# EasyEDA Pro project ProPrj_32最小系统_2025-06-29.epro

# Schematic Schematic1

## Sheets
1 P1: Board Name: Board1; Create Date: 2025-01-07; Page Name: P1; Project Name: 32最小系统; Schematic Name: Schematic1; Update Date: 2025-01-07; Company: 嘉立创EDA; Page Size: A4; Version: V1.0
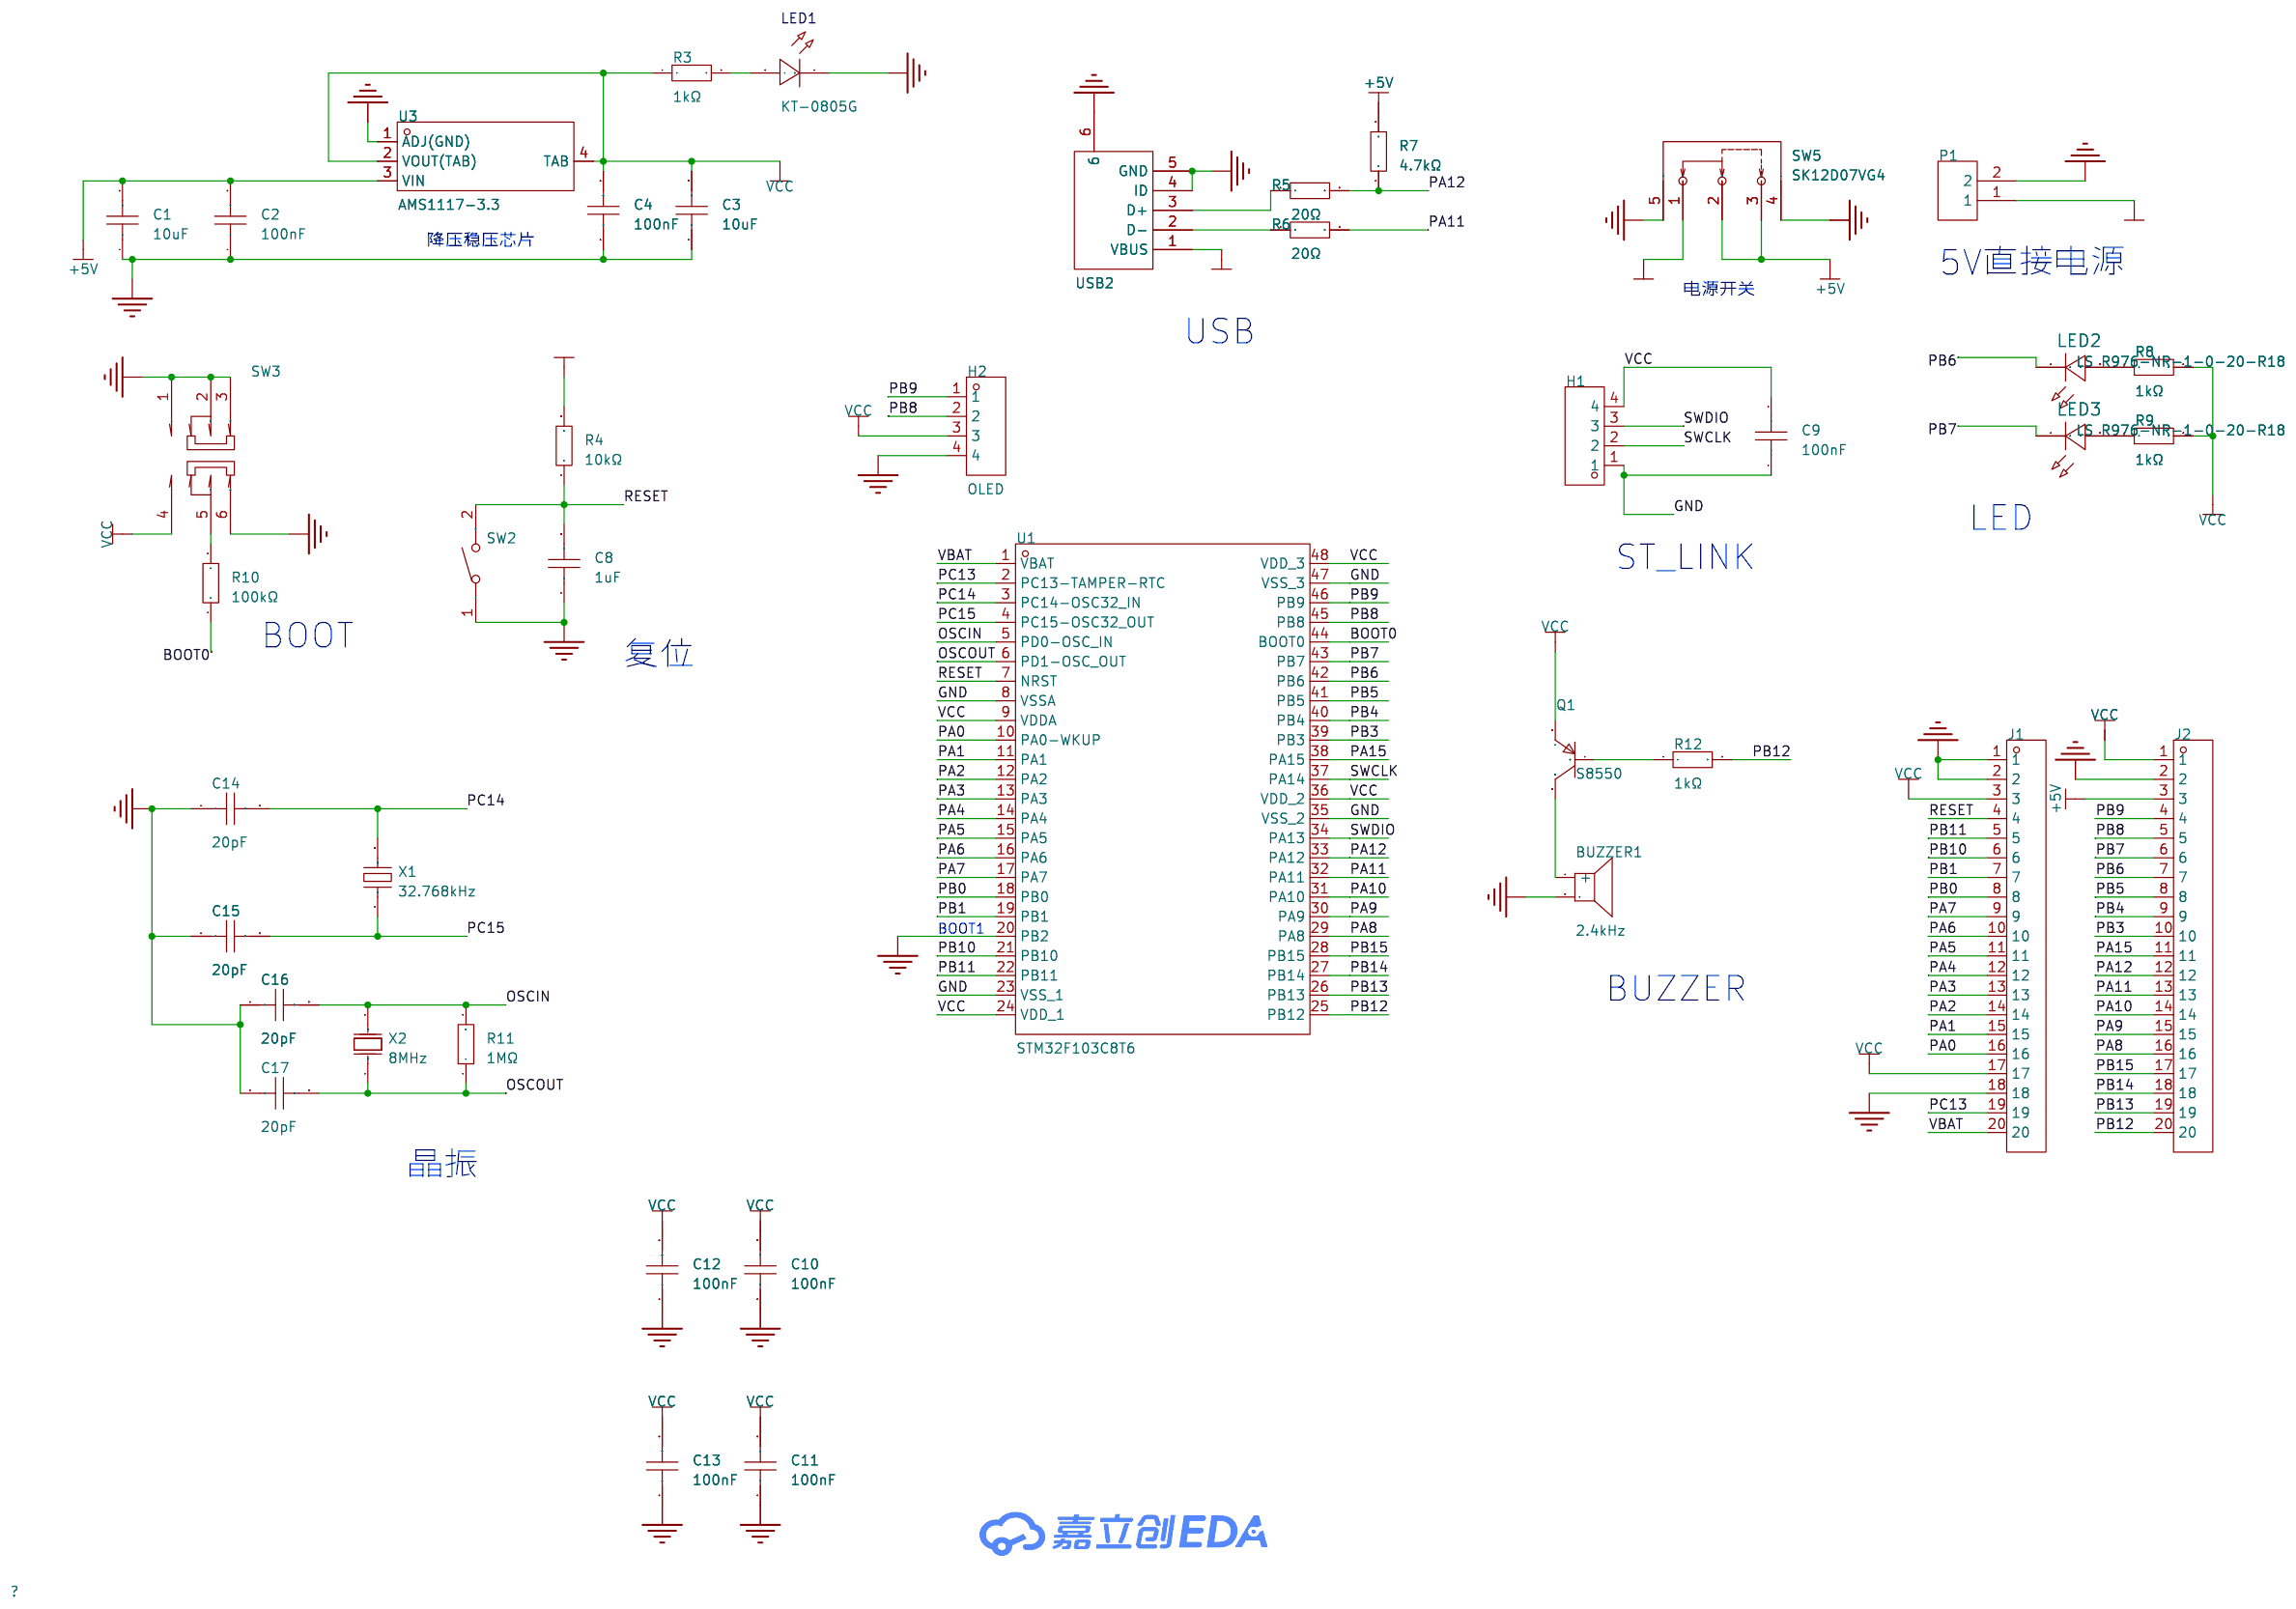
[diagram p0: P1]
2 P2: Page Name: P2
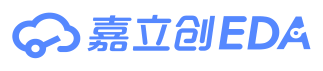
[diagram p1: P2]

## Parts
BUZZER1  2.4kHz  [BUZ-TH_BD12.0-P7.60-D0.6-FD]
C1  10uF  [C0805]
C2  100nF  [C0805]
C3  10uF  [C0805]
C4  100nF  [C0805]
C8  1uF  [C0805]
C9  100nF  [C0805]
C10  100nF  [C0805]
C11  100nF  [C0805]
C12  100nF  [C0805]
C13  100nF  [C0805]
C14  20pF  [C0805]
C15  20pF  [C0805]
C16  20pF  [C0805]
C17  20pF  [C0805]
H1  PZ254V-11-04P  [HDR-TH_4P-P2.54-V-M]
H2  OLED  [HDR-TH_4P-P2.54-V-F]
J1  2.54-1*20P直针  [HDR-TH_20P-P2.54-V-M-1]
J2  2.54-1*20P直针  [HDR-TH_20P-P2.54-V-M-1]
LED1  KT-0805G  [LED0805-R-RD]
LED2  LS R976-NR-1-0-20-R18  [LED0805-RD_RED]
LED3  LS R976-NR-1-0-20-R18  [LED0805-RD_RED]
P1  WJ500V-5.08-2P  [CONN-TH_2P-P5.00_WJ500V-5.08-2P]
Q1  S8550  [SOT-23-3_L2.9-W1.3-P1.90-LS2.4-BR]
R3  1kΩ  [R0805]
R4  10kΩ  [R0805]
R5  20Ω  [R0805]
R6  20Ω  [R0805]
R7  4.7kΩ  [R0805]
R8  1kΩ  [R0805]
R9  1kΩ  [R0805]
R10  100kΩ  [R0805]
R11  1MΩ  [R0805]
R12  1kΩ  [R0805]
SW2  TS-1088-AR02016  [SW-SMD_L3.9-W3.0-P4.45]
SW3  SS-3235S-L1  [SW-SMD_SS-3235S-LX]
SW5  SK12D07VG4  [SW-TH_SK12D07VG4]
U1  STM32F103C8T6  [LQFP-48_L7.0-W7.0-P0.50-LS9.0-BL]
U3  AMS1117-3.3  [SOT-223-4_L6.5-W3.5-P2.30-LS7.0-BR]
USB2  MICRO5.9mmusb  [MICRO-USB-SMD_5P-P0.65-H-F_MICRO5.9MMUSB]
X1  32.768kHz  [CRYSTAL-SMD_L7.0-W3.2-LS7.5]
X2  8MHz  [HC-49US_L11.5-W4.5-P4.88]

## Library data of the parts
BUZZER1 = TMB12A05_C96093: 驱动方式:有源(内含驱动线路);构造类型:电磁式;额定电压:-;频率:2.4kHz;声压(SPL):85dB;; LCSC Part Name: TMB12A05; Supplier Part: C96093; Manufacturer: 华能; Manufacturer Part: TMB12A05; Supplier Footprint: 插件,D=12mm; JLCPCB Part Class: Extended Part; Datasheet: https://atta.szlcsc.com/upload/public/pdf/source/20241025/8A17FE04D767D19A35A06DEF9A82AB1E.pdf; Supplier: LCSC; Oscillator Circuit: 有源(内含驱动线路); Technology Type: 电磁式; Operating Voltage: 4V~8V; Sound Pressure Level (SPL): 85dB; Diameter (φD): 12mm; Height: 9.8mm; Driver Circuitry: 有源(内含驱动线路); Technology: 电磁式; Voltage - Supply: 4V~8V; Sound Pressure Level(SPL): 85dB; Diameter(φD): 12mm
C1 C3 = CL21A106KOQNNNE: 容值:10uF;精度:±10%;额定电压:16V;材质(温度系数):X5R;; LCSC Part Name: 10uF ±10% 16V; Supplier Part: C1713; Manufacturer: SAMSUNG(三星); Supplier Footprint: 0805; JLCPCB Part Class: Extended Part; Datasheet: https://atta.szlcsc.com/upload/public/pdf/source/20160218/1457707763339.pdf; Supplier: LCSC; Tolerance: ±10%; Voltage Rated: 16V; Temperature Coefficient: X5R
C2 C4 C9-C13 = CC0805KRX7R9BB104: 容值:100nF;精度:±10%;额定电压:50V;材质(温度系数):X7R;; LCSC Part Name: 100nF ±10% 50V; Supplier Part: C49678; Manufacturer: YAGEO(国巨); Supplier Footprint: 0805; JLCPCB Part Class: Basic Part; Datasheet: https://atta.szlcsc.com/upload/public/pdf/source/20180224/C181747_15194369449651363981.pdf; Supplier: LCSC; Tolerance: ±10%; Voltage Rated: 50V; Temperature Coefficient: X7R
C8 = CL21B105KBFNNNE: 容值:1uF;精度:±10%;额定电压:50V;材质(温度系数):X7R;; LCSC Part Name: 1uF ±10% 50V; Supplier Part: C28323; Manufacturer: SAMSUNG(三星); Supplier Footprint: 0805; JLCPCB Part Class: Basic Part; Datasheet: https://atta.szlcsc.com/upload/public/pdf/source/20160218/1457707763339.pdf; Supplier: LCSC; Tolerance: ±10%; Voltage Rated: 50V; Temperature Coefficient: X7R
C14-C17 = CL21C200JBANNNC: 容值:20pF;精度:±5%;额定电压:50V;材质(温度系数):C0G;; LCSC Part Name: 20pF ±5% 50V; Supplier Part: C1798; Manufacturer: SAMSUNG(三星); Supplier Footprint: 0805; JLCPCB Part Class: Basic Part; Datasheet: https://atta.szlcsc.com/upload/public/pdf/source/20160218/1457707763339.pdf; Supplier: LCSC; Tolerance: ±5%; Voltage Rated: 50V; Temperature Coefficient: C0G
H1 = PZ254V-11-04P: 插针结构:1x4P;间距:2.54mm;行距:-;圆针/方针:方针;安装类型:直插;排数:单排;总PIN位数:4P;额定电流:3A;额定电压:250V;配合针长度:6mm;塑高:2.5mm;端接针长度:3mm;触头材质:-;工作温度范围:-40℃~+105℃;颜色:黑色;; LCSC Part Name: 间距:2.54mm 1x4P 直插 方针; Supplier Part: C2691448; Manufacturer: XFCN(兴飞); Supplier Footprint: 插件,P=2.54mm; JLCPCB Part Class: 扩展库; Datasheet: https://atta.szlcsc.com/upload/public/pdf/source/20200309/C492403_F9F19131791D08044AD4F84F8E751A34.pdf; Supplier: LCSC; Pin Structure: 1x4P; Pitch: 2.54mm; Circluar Pins/Square Pins: 方针; Mounting Type: 直插; Number of Rows: 单排; Number of Pins: 4P; Current Rating (Max): 3A; Voltage Rating (Max): 250V; Length of Mating Pin: 6mm; Insulation Height: 2.5mm; Length of End Connection Pin: 3mm; Operating Temperature Range: -40℃~+105℃; Color: 黑色
H2 = 2.54-1*4P母: 插孔结构:1x4P;间距:2.54mm;行距:-;圆孔/方孔:方孔;安装类型:直插;排数:单排;总孔位数:4P;额定电流:3A;额定电压:-;插孔方向:顶部;塑高:-;触头材质:青铜;触头镀层:-;工作温度范围:-40℃~+105℃;焊接温度(最大值):-;; LCSC Part Name: 间距:2.54mm 1x4P 直插; Supplier Part: C2718488; Manufacturer: BOOMELE(博穆精密); Supplier Footprint: 插件,P=2.54mm; JLCPCB Part Class: 扩展库; Datasheet: https://atta.szlcsc.com/upload/public/pdf/source/20210301/C2718488_F4427B881E42CAA8DDB0B1C12B3A522C.pdf; Supplier: LCSC; Holes Structure: 1x4P; Pitch: 2.54mm; Circular Hole / Square Hole: 方孔; Mounting Type: 直插; Number of Rows: 单排; Number of Holes: 4P; Current Rating (Max): 3A; Holes Direction: 顶部; Contact Material: 青铜; Operating Temperature Range: -40℃~+105℃
J1 J2 = 2.54-1*20P直针: 插针结构:1x20P;间距:2.54mm;行距:-;圆针/方针:方针;安装类型:直插;排数:单排;总PIN位数:20P;额定电流:3A;额定电压:-;配合针长度:-;塑高:-;端接针长度:-;触头材质:黄铜;触头镀层:-;工作温度范围:-40℃~+105℃;颜色:黑色;; LCSC Part Name: 间距:2.54mm 1x20P 直插 方针; Supplier Part: C50981; Manufacturer: BOOMELE(博穆精密); Supplier Footprint: 插件,P=2.54mm; JLCPCB Part Class: 扩展库; Datasheet: https://atta.szlcsc.com/upload/public/pdf/source/20151109/1457707572883.pdf; Supplier: LCSC; Pin Structure: 1x20P; Pitch: 2.54mm; Circluar Pins/Square Pins: 方针; Mounting Type: 直插; Number of Rows: 单排; Number of Pins: 20P; Current Rating (Max): 3A; Contact Material: 黄铜; Operating Temperature Range: -40℃~+105℃; Color: 黑色
LED1 = KT-0805G: 灯头类型:-;发光颜色:翠绿色;正向电压(VF):-;功率:-;正向电流:-;主波长:-;二极管配置:-;透镜颜色:-;色温:-;发光强度:-;发光角度:-;载带方式:-;工作温度:-;; LCSC Part Name: 0805 翠绿 高亮; Supplier Part: C2297; Manufacturer: KENTO; Supplier Footprint: 0805; JLCPCB Part Class: Basic Part; Datasheet: https://atta.szlcsc.com/upload/public/pdf/source/20170209/1486607340485.pdf; Supplier: LCSC; Emitted Color: 翠绿色
LED2 LED3 = LS R976-NR-1-0-20-R18: LCSC Part Name: 0805红(雾状); Supplier Part: C2899997; Manufacturer: OSRAM(欧司朗); Supplier Footprint: 0805; JLCPCB Part Class: Extended Part; Datasheet: https://atta.szlcsc.com/upload/public/pdf/source/20220714/A56A54169E2209C0CCFAD963EE2FAFD1.pdf; Supplier: LCSC
P1 = WJ500V-5.08-2P: 结构:1x2P;间距:5.08mm;颜色:绿色;安装方式:直插;额定电流:18A;额定电压:250V;排数:1;线规 - AWG:14~30;线规 - 平方毫米:2.5;每排PIN数:2;触头材质:-;触头镀层:-;工作温度范围:-40℃~+105℃;焊接温度(最大值):-;; LCSC Part Name: 1x2P 5.08mm 直插 排数:1 每排P数:2; Supplier Part: C8465; Manufacturer: KANGNEX(康奈克斯电气); Supplier Footprint: 插件,P=5.08mm; JLCPCB Part Class: 扩展库; Datasheet: https://atta.szlcsc.com/upload/public/pdf/source/20191225/C8465_02D34CE5B5B4A53DF5891601D97FA9F4.pdf; Supplier: LCSC; Structure: 1x2P; Pitch: 5.08mm; Color: 绿色; Mounting Style: 直插; Current Rating (Max): 18A; Voltage Rating (Max): 250V; Number of Pins: 2P; Number of Rows: 1; Wire Gauge - AWG: 14~30; Wire Gauge - mm2: 2.5; Number of PINs Per Row: 2; Operating Temperature Range: -40℃~+105℃; Screw Specification: M2.5
Q1 = S8550_C5184407: 晶体管类型:PNP;集电极电流(Ic):500mA;集射极击穿电压(Vceo):25V;功率(Pd):300mW;直流电流增益(hFE@Ic,Vce):120@50mA,1V;; LCSC Part Name: PNP 电流:500mA 耐压:25V; Supplier Part: C5184407; Manufacturer: HXY MOSFET(华轩阳电子); Supplier Footprint: SOT-23; JLCPCB Part Class: 扩展库; Datasheet: https://atta.szlcsc.com/upload/public/pdf/source/20241014/49AFEAC0A66233679E8DD051807D6398.pdf; Supplier: LCSC; Transistor Type: PNP; Collector Current (Ic): 500mA; Collector-Emitter Breakdown Voltage (Vceo): 25V; Power Dissipation (Pd): 300mW; DC Current Gain (hFE@Ic,Vce): 120@50mA,1V; Transition Frequency (fT): 150MHz; Collector Cut-Off Current (Icbo): 100nA; Collector-Emitter Saturation Voltage (VCE(sat)@Ic,Ib): 600mV@500mA,50mA
R3 R8 R9 R12 = 0805W8F1001T5E: 电阻类型:厚膜电阻;阻值:1kΩ;精度:±1%;功率:125mW;最大工作电压:150V;温度系数:±100ppm/℃;; LCSC Part Name: 1kΩ ±1% 125mW 厚膜电阻; Supplier Part: C17513; Manufacturer: UNI-ROYAL(厚声); Supplier Footprint: 0805; JLCPCB Part Class: Basic Part; Datasheet: https://atta.szlcsc.com/upload/public/pdf/source/20200306/C422600_1E6D84923E4A46A82E41ADD87F860B5C.pdf; Supplier: LCSC; Type: 厚膜电阻; Tolerance: ±1%; Power(Watts): 125mW; Overload Voltage (Max): 150V; Temperature Coefficient: ±100ppm/℃; Operating Temperature Range: -55℃~+155℃
R4 = 0805W8F1002T5E_C17414: 电阻类型:厚膜电阻;阻值:10kΩ;精度:±1%;功率:125mW;最大工作电压:150V;温度系数:±100ppm/℃;; LCSC Part Name: 10kΩ ±1% 125mW 厚膜电阻; Supplier Part: C17414; Manufacturer: UNI-ROYAL(厚声); Manufacturer Part: 0805W8F1002T5E; Supplier Footprint: 0805; JLCPCB Part Class: Basic Part; Datasheet: https://atta.szlcsc.com/upload/public/pdf/source/20200306/C422600_1E6D84923E4A46A82E41ADD87F860B5C.pdf; Supplier: LCSC; Type: 厚膜电阻; Tolerance: ±1%; Power(Watts): 125mW; Overload Voltage (Max): 150V; Temperature Coefficient: ±100ppm/℃; Operating Temperature Range: -55℃~+155℃
R5 R6 = 0805W8F200JT5E: 电阻类型:厚膜电阻;阻值:20Ω;精度:±1%;功率:125mW;最大工作电压:150V;温度系数:±200ppm/℃;; LCSC Part Name: 20Ω ±1% 125mW 厚膜电阻; Supplier Part: C17544; Manufacturer: UNI-ROYAL(厚声); Supplier Footprint: 0805; JLCPCB Part Class: Basic Part; Datasheet: https://atta.szlcsc.com/upload/public/pdf/source/20200306/C422600_1E6D84923E4A46A82E41ADD87F860B5C.pdf; Supplier: LCSC; Type: 厚膜电阻; Tolerance: ±1%; Power(Watts): 125mW; Overload Voltage (Max): 150V; Temperature Coefficient: ±200ppm/℃; Operating Temperature Range: -55℃~+155℃
R7 = 0805W8F4701T5E: 电阻类型:厚膜电阻;阻值:4.7kΩ;精度:±1%;功率:125mW;最大工作电压:150V;温度系数:±100ppm/℃;; LCSC Part Name: 4.7kΩ ±1% 125mW 厚膜电阻; Supplier Part: C17673; Manufacturer: UNI-ROYAL(厚声); Supplier Footprint: 0805; JLCPCB Part Class: Basic Part; Datasheet: https://atta.szlcsc.com/upload/public/pdf/source/20200306/C422600_1E6D84923E4A46A82E41ADD87F860B5C.pdf; Supplier: LCSC; Type: 厚膜电阻; Tolerance: ±1%; Power(Watts): 125mW; Overload Voltage (Max): 150V; Temperature Coefficient: ±100ppm/℃; Operating Temperature Range: -55℃~+155℃
R10 = 0805W8F1003T5E: 电阻类型:厚膜电阻;阻值:100kΩ;精度:±1%;功率:125mW;最大工作电压:150V;温度系数:±100ppm/℃;; LCSC Part Name: 100kΩ ±1% 125mW 厚膜电阻; Supplier Part: C149504; Manufacturer: UNI-ROYAL(厚声); Supplier Footprint: 0805; JLCPCB Part Class: Basic Part; Datasheet: https://atta.szlcsc.com/upload/public/pdf/source/20200306/C422600_1E6D84923E4A46A82E41ADD87F860B5C.pdf; Supplier: LCSC; Type: 厚膜电阻; Tolerance: ±1%; Power(Watts): 125mW; Overload Voltage (Max): 150V; Temperature Coefficient: ±100ppm/℃; Operating Temperature Range: -55℃~+155℃
R11 = 0805W8F1004T5E: 电阻类型:厚膜电阻;阻值:1MΩ;精度:±1%;功率:125mW;最大工作电压:150V;温度系数:±100ppm/℃;; LCSC Part Name: 1MΩ ±1% 125mW 厚膜电阻; Supplier Part: C17514; Manufacturer: UNI-ROYAL(厚声); Supplier Footprint: 0805; JLCPCB Part Class: Basic Part; Datasheet: https://atta.szlcsc.com/upload/public/pdf/source/20200306/C422600_1E6D84923E4A46A82E41ADD87F860B5C.pdf; Supplier: LCSC; Type: 厚膜电阻; Tolerance: ±1%; Power(Watts): 125mW; Overload Voltage (Max): 150V; Temperature Coefficient: ±100ppm/℃; Operating Temperature Range: -55℃~+155℃
SW2 = TS-1088-AR02016: 电路结构:单刀单掷;按钮形状:圆形按钮;作用力:160gf;安装方式:立贴;开关长度:4mm;开关宽度:3mm;开关高度:2mm;带支架:不带;触点电流:50mA;额定电压(DC):12V;绝缘电阻:100MΩ;机械寿命:10万次;; LCSC Part Name: 4*3*2mm 立贴 轻触开关; Supplier Part: C720477; Manufacturer: XUNPU(讯普); Supplier Footprint: SMD; JLCPCB Part Class: 扩展库; Datasheet: https://atta.szlcsc.com/upload/public/pdf/source/20200810/C720475_60D09DD6C54279ADDB2DC25100F1CC11.pdf; Supplier: LCSC; Circuit: 单刀单掷; Actuator Style: 圆形按钮; Operating Force: 160gf; Mounting Style: 立贴; Switch Length: 4mm; Switch Width: 3mm; Switch Height: 2mm; Strike Gundam: 不带; Contact Current: 50mA; Voltage Rating (DC): 12V; Insulation Resistance: 100MΩ; Actuator/Cap Color: 黑色; Pin Style: SMD接片; Mechanical Life: 10万次; Operating Temperature: -30℃~+80℃
SW3 = SS-3235S-L1: 电路结构:双刀双掷;安装方式:卧贴;开关颜色:黑色;额定电流(DC):50mA;额定电压(DC):12V;额定电流(AC):50mA;额定电压(AC):12V;机械寿命:1万次;; LCSC Part Name: 柄长2mm 卧贴双档 滑动开关; Supplier Part: C500055; Manufacturer: XKB Connectivity(中国星坤); Supplier Footprint: SMD; JLCPCB Part Class: 扩展库; Datasheet: https://atta.szlcsc.com/upload/public/pdf/source/20211011/39D516E750C13BE9339464E723D9F132.pdf; Supplier: LCSC; Circuit: 双刀双掷; Actuator Style: 矩形柱状; Pin Style: 鸥翼型; Switch Length: 9.1mm; Switch Width: 3.55mm; Switch Height: 3.2mm; Mounting Style: 卧贴; Actuator Color: 黑色; Current Rating (DC): 50mA; Voltage Rating (DC): 12V; Current Rating (AC): 50mA; Voltage Rating (AC): 12V; Mechanical Life: 1万次; Operating Temperature: -40℃~+85℃
SW5 = SK12D07VG4: 电路结构:单刀双掷;安装方式:-;额定电流(DC):500mA;额定电压(DC):50V;额定电流(AC):-;额定电压(AC):-;机械寿命:5千次;; LCSC Part Name: 3脚2档位 卧插 滑动开关; Supplier Part: C393937; Manufacturer: SHOU HAN(首韩); Supplier Footprint: 插件; JLCPCB Part Class: 扩展库; Datasheet: https://atta.szlcsc.com/upload/public/pdf/source/20190521/C393937_939FE26E571CC67D2D532E953108A1B0.pdf; Supplier: LCSC; Circuit: 单刀双掷; Actuator Style: 矩形柱状; Pin Style: PC引脚; Switch Height: 8.8mm; Current Rating (DC): 500mA; Voltage Rating (DC): 50V; Mechanical Life: 5千次
U1 = STM32F103C8T6: CPU内核:ARM-M3;CPU最大主频:72MHz;应用领域:-;; LCSC Part Name: 主流增强型ARM Cortex-M3 MCU，具有64 KB Flash、72 MHz CPU、电机控制、USB和CAN; Supplier Part: C8734; Manufacturer: ST(意法半导体); Supplier Footprint: LQFP-48(7x7); JLCPCB Part Class: 扩展库; Datasheet: https://atta.szlcsc.com/upload/public/pdf/source/20220812/8363ACEC51AD55ECEB84799464F7CB85.pdf; Supplier: LCSC; CPU Core: ARM-M3; CPU Maximum Speed: 72MHz; Program Storage Size: 64KB; Program Memory Type: FLASH; GPIO Ports Number: 37; ADC (Bit): 12bit; Low Voltage Detection Threshold: 2V~3.6V
U3 = AMS1117-3.3_C347222: 输出类型:固定;工作电压:12V;输出电压:3.3V;输出电流:1A;电源纹波抑制比(PSRR):60dB@(120Hz);输出极性:正极;; LCSC Part Name: 输出:3.3V 电流:1A 耐压:12V; Supplier Part: C347222; Manufacturer: UMW(友台半导体); Supplier Footprint: SOT-223; JLCPCB Part Class: 扩展库; Datasheet: https://atta.szlcsc.com/upload/public/pdf/source/20241218/BAF0263FA2E44BCD8AF41AA4FA04EFAA.pdf; Supplier: LCSC; Output Type: 固定; Maximum Input Voltage: 12V; Output Voltage: 3.3V; Output Current: 1A; Power Supply Rejection Ratio (PSRR): 60dB@(120Hz); Dropout Voltage: 1.3V@(1A); Feature: 过流保护(OCP); Output Polarity: 正极; Number of Outputs: 1
USB2 = MICRO5.9mmusb: 连接器类型:Micro-B;标准:USB 2.0;公母:母;安装方式:卧贴;触点数量:5P;端口数量:1;额定电流 - 电源:1A;工作温度范围:-30℃~+80℃;; LCSC Part Name: Micro-B 母 卧贴; Supplier Part: C393940; Manufacturer: SHOU HAN(首韩); Supplier Footprint: SMD; JLCPCB Part Class: 扩展库; Datasheet: https://atta.szlcsc.com/upload/public/pdf/source/20190521/C393940_82CD1DF5E736059CF3459BCCC801B05D.pdf; Supplier: LCSC; Connector Type: Micro-B; Standard: USB 2.0; Gender: 母; Mounting Style: 卧贴; Number of Contacts: 5P; Number of Ports: 1; Current Rating - Power (Max): 1A; Operating Temperature Range: -30℃~+80℃; Core Colour: 黑色
X1 = FL37S2-32.768-NLLLDTL: 晶振类型:贴片晶振;频率:32.768kHz;常温频差:±20ppm;外接负载电容:12.5pF;频率稳定度(全温):±20ppm;; LCSC Part Name: 32.768kHz ±20ppm 12.5pF; Supplier Part: C3034396; Manufacturer: HCI(杭晶); Supplier Footprint: HC-49S-SMD-2P-Mini; JLCPCB Part Class: 扩展库; Datasheet: https://atta.szlcsc.com/upload/public/pdf/source/20220609/D6453C9B3A997B38AB72F764D1E691DB.pdf; Supplier: LCSC; Crystal Type: 贴片晶振; Normal temperature Frequency Tolerance: ±20ppm; External load capacitor: 12.5pF; Frequency Stability(Full temperature range): ±20ppm; Operating Temperature: -40℃~+85℃
X2 = TAXD8M2GLFBET2T: 晶振类型:直插晶振;频率:8MHz;常温频差:±30ppm;外接负载电容:20pF;频率稳定度(全温):±30ppm;; LCSC Part Name: 8MHz ±30ppm 20pF; Supplier Part: C107425; Manufacturer: YJX(雅晶鑫); Supplier Footprint: HC-49S; JLCPCB Part Class: 扩展库; Datasheet: https://atta.szlcsc.com/upload/public/pdf/source/20170914/C127676_1505359415156967690.pdf; Supplier: LCSC; Crystal Type: 直插晶振; Normal temperature Frequency Tolerance: ±30ppm; External load capacitor: 20pF; Frequency Stability(Full temperature range): ±30ppm; Equivalent Series Resistance (ESR): 80Ω; Operating Temperature: -20℃~+70℃

## Nets
+5V: C1.2 C2.2 J2.3 R7.2 SW5.2 SW5.3 U3.3(VIN)
+5V_IN: P1.1 SW5.1 USB2.1(VBUS)
GND: BUZZER1.2 C1.1 C2.1 C3.1 C4.1 C8.1 C9.1 C10.1 C11.1 C12.1 C13.1 C14.1 C15.1 C16.1 C17.1 H1.1 H2.4 J1.1 J1.2 J1.18 J2.2 LED1.1(C) P1.2 SW2.1 SW3.1 SW3.2 SW3.3 SW3.6 SW5.4 SW5.5 U1.8(VSSA) U1.20(PB2) U1.23(VSS_1) U1.35(VSS_2) U1.47(VSS_3) U3.1(ADJ(GND)) USB2.4(ID) USB2.5(GND) USB2.6
VBAT: J1.20 U1.1(VBAT)
VCC: C3.2 C4.2 C9.2 C10.2 C11.2 C12.2 C13.2 H1.4 H2.3 J1.3 J1.17 J2.1 Q1.2(E) R3.1 R4.2 R8.2 R9.2 SW3.4 U1.9(VDDA) U1.24(VDD_1) U1.36(VDD_2) U1.48(VDD_3) U3.2(VOUT(TAB)) U3.4(TAB)
BOOT0: R10.1 U1.44(BOOT0)
OSCIN: C16.2 R11.2 U1.5(PD0-OSC_IN) X2.2(OSC2)
OSCOUT: C17.2 R11.1 U1.6(PD1-OSC_OUT) X2.1(OSC1)
PA0: J1.16 U1.10(PA0-WKUP)
PA1: J1.15 U1.11(PA1)
PA2: J1.14 U1.12(PA2)
PA3: J1.13 U1.13(PA3)
PA4: J1.12 U1.14(PA4)
PA5: J1.11 U1.15(PA5)
PA6: J1.10 U1.16(PA6)
PA7: J1.9 U1.17(PA7)
PA8: J2.16 U1.29(PA8)
PA9: J2.15 U1.30(PA9)
PA10: J2.14 U1.31(PA10)
PA11: J2.13 R6.2 U1.32(PA11)
PA12: J2.12 R5.2 R7.1 U1.33(PA12)
PA15: J2.11 U1.38(PA15)
PB0: J1.8 U1.18(PB0)
PB1: J1.7 U1.19(PB1)
PB3: J2.10 U1.39(PB3)
PB4: J2.9 U1.40(PB4)
PB5: J2.8 U1.41(PB5)
PB6: J2.7 LED2.1(C) U1.42(PB6)
PB7: J2.6 LED3.1(C) U1.43(PB7)
PB8: H2.2 J2.5 U1.45(PB8)
PB9: H2.1 J2.4 U1.46(PB9)
PB10: J1.6 U1.21(PB10)
PB11: J1.5 U1.22(PB11)
PB12: J2.20 R12.2 U1.25(PB12)
PB13: J2.19 U1.26(PB13)
PB14: J2.18 U1.27(PB14)
PB15: J2.17 U1.28(PB15)
PC13: J1.19 U1.2(PC13-TAMPER-RTC)
PC14: C14.2 U1.3(PC14-OSC32_IN) X1.2(GND)
PC15: C15.2 U1.4(PC15-OSC32_OUT) X1.1
RESET: C8.2 J1.4 R4.1 SW2.2 U1.7(NRST)
SWCLK: H1.2 U1.37(PA14)
SWDIO: H1.3 U1.34(PA13)
$1N2331: R5.1 USB2.3(D+)
$1N2336: R6.1 USB2.2(D-)
$1N5496: Q1.1(B) R12.1
Net-(BUZZER1-1): BUZZER1.1(+) Q1.3(C)
Net-(LED1-2): LED1.2(A) R3.2
Net-(LED2-2): LED2.2(A) R8.1
Net-(LED3-2): LED3.2(A) R9.1
Net-(R10-2): R10.2 SW3.5

## Notes on the sheets
sheet 1
- 降压稳压芯片
- 电源开关
- 5V直接电源
- USB
- LED
- ST_LINK
- BOOT
- 复位
- BOOT1
- BUZZER
- 晶振

# Board PCB1
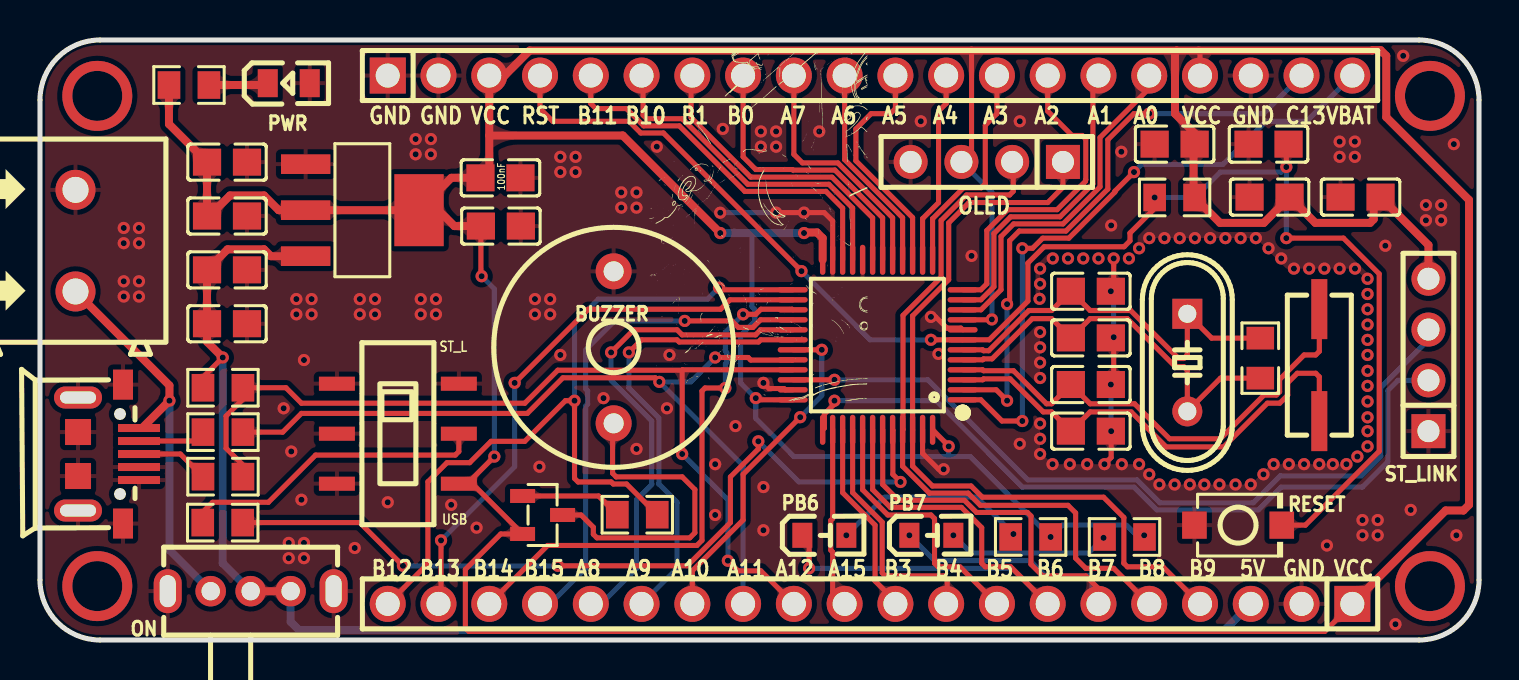
[diagram p2: board, top side]
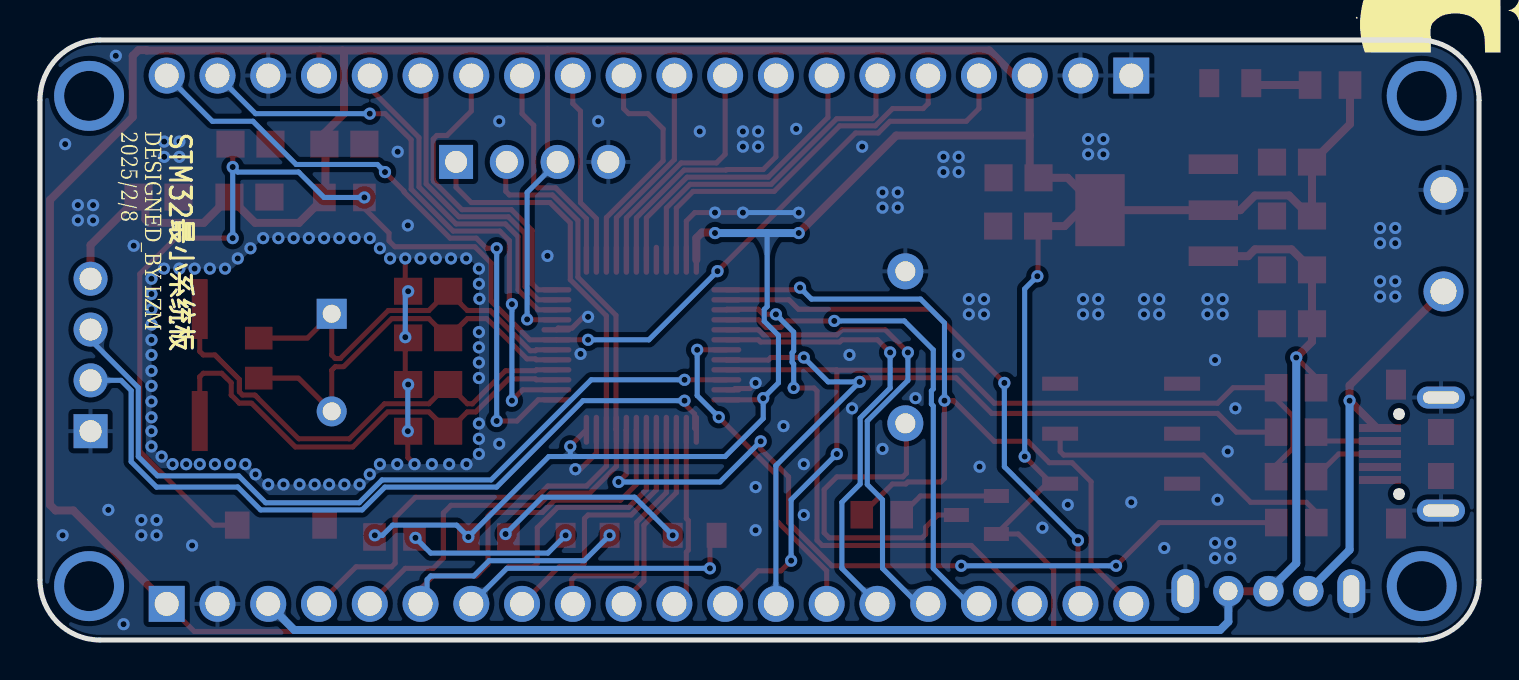
[diagram p3: board, bottom side, seen from below]

Outline 72 x 30 mm; copper layers: Top Layer, Bottom Layer. Coordinates in mm from the lower left corner of the outline.
Outline path: 0,27 0,3 arc(0.88,0.88) 3,0 69,0 arc(71.12,0.88) 72,3 72,27 arc(71.12,29.12) 69,30 3,30 arc(0.88,29.12) 0,27
Stack: Top Layer 0.035mm / Dielectric1 1.51mm FR4 er 4.5 / Bottom Layer 0.035mm

## Design rules (mm)
net PC14: DP2
net PC15: DP2
net OSCIN: DP1
net OSCOUT: DP1
template: JLCPCB Capability(Two Layers Board)
spacing copperThickness1oz (default): track to track 0.102, other pairs 0.152 to 0.3
spacing copperThickness2oz: track to track 0.203, other pairs 0.152 to 0.3
track width copperThickness1oz (default): min 0.127, default 0.254, max 2.54
track width copperThickness2oz: min 0.203, default 0.254, max 2.54
differential pair differentialPair (default): width min 0.127, default 0.254, max 2.54; gap min 0.152, default 0.152
via viaSize (default): diameter min 0.5, default 0.61, max 10; hole min 0.3, default 0.305, max 6.3

## Placement (name value [footprint] x y rotation side)
BUZZER  2.4kHz  [BUZ-TH_BD12.0-P7.60-D0.6-FD]  28.7 14.63 90 top
C1  10uF  [C0805]  9.36 15.81 180 top
C2  100nF  [C0805]  9.36 18.51 180 top
C3  10uF  [C0805]  9.36 21.2 180 top
C4  100nF  [C0805]  9.36 23.89 180 top
C8  1uF  [C0805]  61.47 24.79 0 top
C9  100nF  [C0805]  56.77 24.79 0 top
C10  100nF  [C0805]  23.04 23.11 180 top
C11  100nF  [C0805]  23.06 20.7 180 top
C12  100nF  [C0805]  61.52 22.14 0 top
C13  100nF  [C0805]  66.07 22.14 0 top
C14  20pF  [C0805]  52.58 10.44 180 top
C15  20pF  [C0805]  52.58 12.77 180 top
C16  20pF  [C0805]  52.58 15.11 180 top
C17  20pF  [C0805]  52.58 17.44 180 top
H2  OLED  [HDR-TH_4P-P2.54-V-F]  47.37 23.9 180 top
J1  2.54-1*20P直针  [HDR-TH_20P-P2.54-V-M-1]  41.53 28.22 0 top
J2  2.54-1*20P直针  [HDR-TH_20P-P2.54-V-M-1]  41.53 1.81 180 top
ON  SK12D07VG4  [SW-TH_SK12D07VG4]  10.54 2.44 0 top
P1  WJ500V-5.08-2P  [CONN-TH_2P-P5.00_WJ500V-5.08-2P]  1.78 19.97 90 top
PB6  LS R976-NR-1-0-20-R18  [LED0805-RD_RED]  39.24 5.23 0 top
PB7  LS R976-NR-1-0-20-R18  [LED0805-RD_RED]  44.6 5.23 0 top
PWR  KT-0805G  [LED0805-R-RD]  12.45 27.84 0 top
Q1  S8550  [SOT-23-3_L2.9-W1.3-P1.90-LS2.4-BR]  25.15 6.25 180 top
R3  1kΩ  [R0805]  7.45 27.75 0 top
R4  10kΩ  [R0805]  56.77 22.13 0 top
R5  20Ω  [R0805]  9.16 8.17 0 top
R6  20Ω  [R0805]  9.16 10.39 0 top
R7  4.7kΩ  [R0805]  9.16 12.61 180 top
R8  1kΩ  [R0805]  49.57 5.15 0 top
R9  1kΩ  [R0805]  54.26 5.15 0 top
R10  100kΩ  [R0805]  9.14 5.87 180 top
R11  1MΩ  [R0805]  61.05 14.09 270 top
R12  1kΩ  [R0805]  29.88 6.26 0 top
RESET  TS-1088-AR02016  [SW-SMD_L3.9-W3.0-P4.45]  59.94 5.74 0 top
ST_LINK  PZ254V-11-04P  [HDR-TH_4P-P2.54-V-M]  69.47 14.25 90 top
U1  STM32F103C8T6  [LQFP-48_L7.0-W7.0-P0.50-LS9.0-BL]  41.91 14.76 90 top
U3  AMS1117-3.3  [SOT-223-4_L6.5-W3.5-P2.30-LS7.0-BR]  16.13 21.49 180 top
USB  SS-3235S-L1  [SW-SMD_SS-3235S-LX]  17.91 10.31 90 top
USB2  MICRO5.9mmusb  [MICRO-USB-SMD_5P-P0.65-H-F_MICRO5.9MMUSB]  3.43 9.3 270 top
X1  32.768kHz  [CRYSTAL-SMD_L7.0-W3.2-LS7.5]  64.01 13.74 270 top
X2  8MHz  [HC-49US_L11.5-W4.5-P4.88]  57.4 13.87 270 top

## Footprints (pads in the part's own frame, mm; a bottom-side part is the same pattern mirrored in y, then rotated)
BUZ-TH_BD12.0-P7.60-D0.6-FD
  round 1.8 hole 1: 1(-3.8,0) 2(3.8,0)
C0805
  rect 1.41x1.35 smd: 1(-1,0) 2(1,0)
CONN-TH_2P-P5.00_WJ500V-5.08-2P
  round 2 hole 1.3: 1(-2.54,0) 2(2.54,0)
CRYSTAL-SMD_L7.0-W3.2-LS7.5
  rect 3x0.8 smd: 1(-2.8,0) 2(2.8,0)
HC-49US_L11.5-W4.5-P4.88
  rect 1.5x1.5 hole 0.9: 1(-2.44,0)
  round 1.5 hole 0.9: 2(2.44,0)
HDR-TH_4P-P2.54-V-F
  rect 1.7x1.7 hole 1.1: 1(-3.81,0)
  round 1.7 hole 1.1: 2(-1.27,0) 3(1.27,0) 4(3.81,0)
HDR-TH_4P-P2.54-V-M
  rect 1.7x1.7 hole 1.1: 1(-3.81,0)
  round 1.7 hole 1.1: 2(-1.27,0) 3(1.27,0) 4(3.81,0)
HDR-TH_20P-P2.54-V-M-1
  rect 1.8x1.8 hole 1.2: 1(-24.13,0)
  round 1.8 hole 1.2: 2(-21.59,0) 3(-19.05,0) 4(-16.51,0) 5(-13.97,0) 6(-11.43,0) 7(-8.89,0) 8(-6.35,0) 9(-3.81,0) 10(-1.27,0) 11(1.27,0) 12(3.81,0) 13(6.35,0) 14(8.89,0) 15(11.43,0) 16(13.97,0) 17(16.51,0) 18(19.05,0) 19(21.59,0) 20(24.13,0)
LED0805-R-RD
  rect 1x1.399 smd: 1(1.05,0) 2(-1.05,0)
LED0805-RD_RED
  rect 1x1.25 smd: 1(-1.1,0) 2(1.1,0)
LQFP-48_L7.0-W7.0-P0.50-LS9.0-BL
  oval 0.27x1.5 smd: 1(-2.75,-4.25) 2(-2.25,-4.25) 3(-1.75,-4.25) 4(-1.25,-4.25) 5(-0.75,-4.25) 6(-0.25,-4.25) 7(0.25,-4.25) 8(0.75,-4.25) 9(1.25,-4.25) 10(1.75,-4.25) 11(2.25,-4.25) 12(2.75,-4.25) 25(2.75,4.25) 26(2.25,4.25) 27(1.75,4.25) 28(1.25,4.25) 29(0.75,4.25) 30(0.25,4.25) 31(-0.25,4.25) 32(-0.75,4.25) 33(-1.25,4.25) 34(-1.75,4.25) 35(-2.25,4.25) 36(-2.75,4.25)
  oval 1.5x0.27 smd: 13(4.25,-2.75) 14(4.25,-2.25) 15(4.25,-1.75) 16(4.25,-1.25) 17(4.25,-0.75) 18(4.25,-0.25) 19(4.25,0.25) 20(4.25,0.75) 21(4.25,1.25) 22(4.25,1.75) 23(4.25,2.25) 24(4.25,2.75) 37(-4.25,2.75) 38(-4.25,2.25) 39(-4.25,1.75) 40(-4.25,1.25) 41(-4.25,0.75) 42(-4.25,0.25) 43(-4.25,-0.25) 44(-4.25,-0.75) 45(-4.25,-1.25) 46(-4.25,-1.75) 47(-4.25,-2.25) 48(-4.25,-2.75)
MICRO-USB-SMD_5P-P0.65-H-F_MICRO5.9MMUSB
  rect 0.4x2.1 smd: 1(-1.3,1.525) 2(-0.65,1.525) 3(0,1.525) 4(0.65,1.525) 5(1.3,1.525)
  rect 1.5x1 smd: 6(-3.47,0.725) 6(3.476,0.725)
  oval 1.1x2.4 hole 0.6x1.8: 6(-2.825,-1.525) 6(2.825,-1.525)
  rect 1.3x1.3 smd: 6(-1.1,-1.525) 6(1.1,-1.525)
R0805
  rect 1.133x1.377 smd: 1(-1,0) 2(1,0)
SOT-23-3_L2.9-W1.3-P1.90-LS2.4-BR
  rect 1.25x0.7 smd: 1(1,-0.95) 2(1,0.95) 3(-1,0)
SOT-223-4_L6.5-W3.5-P2.30-LS7.0-BR
  rect 2.47x0.98 smd: 1(2.835,-2.3) 2(2.835,0) 3(2.835,2.3)
  rect 2.47x3.6 smd: 4(-2.835,0)
SW-SMD_L3.9-W3.0-P4.45
  rect 1.23x1.36 smd: 1(-2.185,0) 2(2.185,0)
SW-SMD_SS-3235S-LX
  rect 0.7x1.8 smd: 1(-2.5,3.05) 2(0,3.05) 3(2.5,3.05) 4(-2.5,-3.05) 5(0,-3.05) 6(2.5,-3.05)
SW-TH_SK12D07VG4
  round 1.524 hole 0.914: 1(-2,0) 2(0,0) 3(2,0)
  oval 1.4x2.2 hole 0.8x1.6: 4(4.15,0) 5(-4.15,0)

## Nets
+5V: C1.2 C2.2 J2.3 ON.2 ON.3 R7.2 U3.3
+5V_IN: ON.1 P1.1 USB2.1
GND: BUZZER.2 C1.1 C2.1 C3.1 C4.1 C8.1 C9.1 C10.1 C11.1 C12.1 C13.1 C14.1 C15.1 C16.1 C17.1 H2.4 J1.1 J1.2 J1.18 J2.2 ON.4 ON.5 P1.2 PWR.1 RESET.1 ST_LINK.1 U1.8 U1.20 U1.23 U1.35 U1.47 U3.1 USB.1 USB.2 USB.3 USB.6 USB2.4 USB2.5 USB2.6
VBAT: J1.20 U1.1
VCC: C3.2 C4.2 C9.2 C10.2 C11.2 C12.2 C13.2 H2.3 J1.3 J1.17 J2.1 Q1.2 R3.1 R4.2 R8.2 R9.2 ST_LINK.4 U1.9 U1.24 U1.36 U1.48 U3.2 U3.4 USB.4
BOOT0: R10.1 U1.44
OSCIN: C16.2 R11.2 U1.5 X2.2
OSCOUT: C17.2 R11.1 U1.6 X2.1
PA0: J1.16 U1.10
PA1: J1.15 U1.11
PA2: J1.14 U1.12
PA3: J1.13 U1.13
PA4: J1.12 U1.14
PA5: J1.11 U1.15
PA6: J1.10 U1.16
PA7: J1.9 U1.17
PA8: J2.16 U1.29
PA9: J2.15 U1.30
PA10: J2.14 U1.31
PA11: J2.13 R6.2 U1.32
PA12: J2.12 R5.2 R7.1 U1.33
PA15: J2.11 U1.38
PB0: J1.8 U1.18
PB1: J1.7 U1.19
PB3: J2.10 U1.39
PB4: J2.9 U1.40
PB5: J2.8 U1.41
PB6: J2.7 PB6.1 U1.42
PB7: J2.6 PB7.1 U1.43
PB8: H2.2 J2.5 U1.45
PB9: H2.1 J2.4 U1.46
PB10: J1.6 U1.21
PB11: J1.5 U1.22
PB12: J2.20 R12.2 U1.25
PB13: J2.19 U1.26
PB14: J2.18 U1.27
PB15: J2.17 U1.28
PC13: J1.19 U1.2
PC14: C14.2 U1.3 X1.2
PC15: C15.2 U1.4 X1.1
RESET: C8.2 J1.4 R4.1 RESET.2 U1.7
SWCLK: ST_LINK.2 U1.37
SWDIO: ST_LINK.3 U1.34
$1N1344: PWR.2 R3.2
$1N2331: R5.1 USB2.3
$1N2336: R6.1 USB2.2
$1N2763: PB6.2 R8.1
$1N2764: PB7.2 R9.1
$1N3345: R10.2 USB.5
$1N5496: Q1.1 R12.1
$1N5497: BUZZER.1 Q1.3

## Via types
v1: diameter 3.5, hole 2.5, Top Layer to Bottom Layer, 4 vias
v2: diameter 0.61, hole 0.305, Top Layer to Bottom Layer, 217 vias

## Routing (per net, layer and track width the routed paths; a pad name or vN(x,y) marks a point on that pad's centre or on a via; arc(x,y) is an arc through that point)
+5V: length 76.7
  Top Layer w0.254: v2(9.14,14.12) 8.16,13.14 R7.2
  Top Layer w0.4: U3.3 11.55,19.19 11.21,19.53 9.38,19.53 C2.2 C1.2 8.36,14.91 v2(9.14,14.12) ; ON.2 ON.3
  Bottom Layer w0.4: ON.3 12.54,0.91 12.95,0.5 59.27,0.5 J2.3 ; ON.2 9.14,3.84 v2(9.14,14.12)
+5V_IN: length 19.9
  Top Layer w0.4: USB2.1 5.11,10.6 v2(6.48,11.97) 6.48,12.73 P1.1
  Bottom Layer w0.4: v2(6.48,11.97) 6.48,4.5 ON.1
GND: length 24.4
  Top Layer w0.254: v2(44.58,16.16) 44.81,16.16 45.37,15.6 46.07,15.6 U1.8 ; v2(53.58,12.77) 53.72,12.92 v2(53.72,15.14) ; v2(36.83,21.37) v2(38.23,21.37) 39.24,21.37 39.66,20.95 U1.23 ; U1.35 37.28,12.51 37.22,12.57 36.48,12.57 v2(36.2,12.85) ; C14.1 v2(53.59,10.44) 53.59,9.13 v2(53.26,8.79) ; v2(53.58,17.44) 53.72,17.58 v2(53.72,19.08) ; U1.47 44.16,9.33 44.96,8.54 v2(45.21,8.54)
  Bottom Layer w0.254: v2(34.04,21.36) 34.04,21.37 v2(36.83,21.37) ; v2(53.58,17.44) 53.72,17.3 v2(53.72,15.14) ; v2(53.59,10.44) 53.59,12.76 v2(53.58,12.77)
  vias: v2(4.19,20.6) v2(4.19,19.84) v2(4.19,17.94) v2(4.19,17.17) v2(4.95,20.6) v2(4.95,19.84) v2(4.95,17.94) v2(4.95,17.17) v2(12.19,11.58) v2(12.45,4.85) v2(12.45,4.09) v2(12.57,9.43) v2(12.83,17.05) v2(12.83,16.28) v2(13.08,7.01) v2(13.21,14) v2(13.21,4.85) v2(13.21,4.09) v2(13.59,17.05) v2(13.59,16.28) v2(15.75,4.6) v2(16,17.05) v2(16,16.28) v2(16.76,17.05) v2(16.76,16.28) v2(17.4,6.89) v2(18.8,25.05) v2(18.8,24.28) v2(19.05,17.05) v2(19.05,16.28) v2(19.56,25.05) v2(19.56,24.28) v2(19.81,17.05) v2(19.81,16.28) v2(20.57,6.76) v2(21.84,5.62) v2(24.77,17.05) v2(24.77,16.28) v2(24.99,8.66) v2(25.53,17.05) v2(25.53,16.28) v2(26.04,24.16) v2(26.04,23.4) v2(26.04,14.25) v2(26.8,24.16) v2(26.8,23.4) v2(28.19,12.09) v2(29.08,22.38) v2(29.08,21.62) v2(29.85,22.38) v2(29.85,21.62) v2(29.85,9.55) v2(30.86,24.67) v2(31.37,11.58) v2(31.5,14.25) v2(33.78,8.79) v2(33.78,6.25) v2(34.16,25.55) v2(34.8,10.7) v2(36.07,25.43) v2(36.07,24.67) v2(36.2,7.65) v2(36.2,5.49) v2(36.83,25.43) v2(36.83,24.67) v2(38.99,25.43) v2(44.07,25.94) v2(44.95,14.3) v2(46.61,19.2) v2(49.02,25.94) v2(49.02,9.81) v2(50.01,17.06) v2(50.04,18.57) v2(50.04,17.81) v2(50.04,15.39) v2(50.04,14.63) v2(50.04,13.87) v2(50.04,13.1) v2(50.04,10.82) v2(50.04,10.06) v2(50.04,9.3) v2(50.67,19.08) v2(50.66,8.79) v2(51.44,19.08) v2(51.53,8.79) v2(52.2,19.08) v2(52.39,8.79) v2(52.96,19.08) v2(53.59,20.73) v2(54.1,24.41) v2(54.13,8.79) v2(54.48,19.08) v2(54.99,19.59) v2(54.99,8.79) v2(55.5,20.09) v2(55.5,8.28) v2(56.01,7.77) v2(56.26,20.09) v2(56.77,7.77) v2(57.02,20.09) v2(57.53,7.77) v2(57.79,20.09) v2(58.26,7.77) v2(58.55,20.09) v2(59.01,7.77) v2(59.31,20.09) v2(59.82,7.77) v2(60.07,20.09) v2(60.58,7.77) v2(60.83,20.09) v2(61.21,8.28) v2(61.47,19.59) v2(61.72,8.79) v2(62.1,19.08) v2(62.48,8.79) v2(62.74,18.57) v2(63.25,8.79) v2(63.5,18.57) v2(64,8.79) v2(64.26,18.57) v2(64.39,4.73) v2(64.68,8.79) v2(65.02,24.92) v2(65.02,24.16) v2(65.02,18.57) v2(65.36,8.79) v2(65.79,24.92) v2(65.79,24.16) v2(65.79,18.57) v2(65.91,9.17) v2(66.17,6) v2(66.17,5.23) v2(66.42,18.06) v2(66.42,17.3) v2(66.42,16.54) v2(66.42,15.77) v2(66.42,15) v2(66.42,14.25) v2(66.42,13.46) v2(66.42,12.71) v2(66.42,11.93) v2(66.42,11.13) v2(66.42,10.44) v2(66.42,9.68) v2(66.93,6) v2(66.93,5.23) v2(67.31,19.71) v2(67.82,0.79) v2(68.2,29.21) v2(68.58,6.5) v2(69.34,21.74) v2(69.34,20.98) v2(70.1,21.74) v2(70.1,20.98) v2(70.74,24.79) v2(70.87,5.23)
VBAT: length 32.2
  Top Layer w0.254: v2(49.15,10.95) 48.13,10.95 47.07,12.01 U1.1 ; v2(49.15,19.59) 49.66,19.59 50.17,20.09 51.48,20.09 53.78,22.4 53.78,22.44 v2(54.74,23.4)
  Bottom Layer w0.254: v2(54.74,23.4) 55.12,23.78 59.18,23.78 61.34,25.94 63.37,25.94 J1.20 ; v2(49.15,10.95) v2(49.15,19.59)
VCC: length 275.7
  Top Layer w0.254: J2.1 64.28,0.43 21.46,0.43 21.28,0.61 21.28,3.53 23.05,5.3 Q1.2 21.63,7.81 21.38,7.81 ; v2(35.81,12.09) 35.9,12.01 U1.36 ; J1.17 58.04,29.41 57.98,29.47 ; U1.9 47.61,16.01 v2(47.63,16.03) ; v2(22.73,9.17) 21.38,7.81 ; 21.38,7.81 USB.4 ; C11.2 22.06,18.23 v2(22.1,18.19) ; 46.61,29.47 46.61,24.41 H2.3 ; v2(45.47,9.68) 45.47,9.7 U1.48 ; C9.2 57.72,24.74
  Top Layer w0.4: C9.2 57.77,25.33 56.79,26.32 56.79,29.4 56.87,29.47 ; 56.87,29.47 66.66,29.47 66.67,29.49 67.08,29.49 67.36,29.21 67.36,26.14 71.5,22 71.5,6.76 71.22,6.48 70.33,6.48 J2.1 ; 56.87,29.47 24.5,29.47 23.25,28.22 J1.3 22.48,25.22 ; C11.2 20.73,20.7 19.94,21.49 U3.4 ; R3.1 6.45,25.8 C4.2 C3.2 8.65,21.49 8.77,21.49 9.51,22.23 11.21,22.23 11.94,21.49 U3.2 U3.4 ; 22.48,25.22 22.48,23.55 C10.2 20.58,23.11 U3.4 ; 22.48,25.22 29.16,25.22 v2(34.04,20.35) ; U1.24 39.16,20.09 38.88,20.38 38.26,20.38 v2(38.23,20.35) ; ST_LINK.4 69.47,19.74 C13.2 66.73,21.8 66.73,21.04 66.55,20.86 63.81,20.86 C12.2 61.23,20.86 59.04,20.86 R4.2 ; 57.72,24.74 57.72,22.18
  Bottom Layer w0.254: 45.41,9.17 37.72,9.17 35.81,11.08 v2(35.81,12.09) 35.05,12.85 35.05,15.23 35.76,15.94 35.76,16.53 35.62,16.67 35.62,20.35 ; 45.41,9.17 45.47,9.23 v2(45.47,9.68) ; 45.41,9.17 46.54,9.17 v2(50.57,5.15) 51.16,5.74 54.36,5.74 54.86,5.23 v2(55.25,5.23) ; v2(22.1,18.19) 22.73,17.55 v2(22.73,9.17) ; H2.3 47.63,22.38 v2(47.63,16.03)
  Bottom Layer w0.4: v2(34.04,20.35) v2(38.23,20.35)
(no net):
  vias: v1(2.87,27.21) v1(2.87,2.69) v1(69.54,27.21) v1(69.54,2.69)
BOOT0: length 41.6
  Top Layer w0.254: v2(18.16,3.71) 16,5.87 R10.1 ; v2(35.94,9.93) 35.94,9.55 34.54,8.16 34.54,5.87 32.39,3.71 v2(25.91,3.71) ; U1.44 42.67,10.5 42.67,8.28 v2(43.05,7.9)
  Bottom Layer w0.254: v2(35.94,9.93) 37.97,7.9 v2(43.05,7.9) ; v2(25.91,3.71) v2(18.16,3.71)
OSCIN: length 20.4
  Top Layer w0.254: R11.2 59.07,13.09 X2.2 57.4,13.49 57.22,13.67 56.8,13.67 54.4,16.07 52.54,16.07 C16.2 50.61,16.07 49.64,16.07 47.63,14.06 47.21,14.06 47.16,14.01 U1.5
OSCOUT: length 20.2
  Top Layer w0.254: R11.1 58.62,15.09 X2.1 57.4,14.25 57.22,14.07 56.97,14.07 54.57,16.47 52.54,16.47 C17.2 50.61,16.47 49.48,16.47 47.47,14.46 47.21,14.46 47.16,14.51 U1.6
PA0: length 17.6
  Top Layer w0.254: J1.16 55.5,27.59 53.04,25.12 53.04,22.66 51.18,20.8 48.72,20.8 48.08,20.17 48.08,17.51 47.08,16.51 U1.10
PA1: length 16
  Top Layer w0.254: U1.11 47.08,17.01 47.73,17.66 47.73,20.32 48.56,21.16 51.04,21.16 52.68,22.8 52.68,27.94 J1.15
PA2: length 16.3
  Top Layer w0.254: U1.12 47.07,17.51 47.37,17.81 47.37,20.47 48.41,21.52 50.89,21.52 52.31,22.94 52.31,23 52.32,23.02 52.32,25.05 52.14,25.23 51.64,25.23 50.42,26.44 J1.14
PA3: length 11.1
  Top Layer w0.254: J1.13 47.88,26.32 47.3,25.73 47.3,22.81 47.09,22.61 46.2,22.61 44.66,21.07 U1.13
PA4: length 9.7
  Top Layer w0.254: U1.14 44.16,21.07 44.96,21.87 44.96,26.44 45.34,26.82 J1.12
PA5: length 11.8
  Top Layer w0.254: J1.11 42.8,26.57 42.55,26.32 41.58,26.32 40.82,25.55 40.82,23.96 43.66,21.12 U1.15
PA6: length 10.4
  Top Layer w0.254: J1.10 40.26,24.02 43.16,21.12 U1.16
PA7: length 12.3
  Top Layer w0.254: J1.9 37.72,24.28 38.15,23.85 39.92,23.85 42.66,21.11 U1.17
PA8: length 24.7
  Top Layer w0.254: v2(28.58,14.38) 29.71,15.51 31.88,15.51 32.13,15.26 35.8,15.26 36.05,15.51 U1.29
  Bottom Layer w0.254: v2(28.58,14.38) 28.58,12.98 30.61,10.95 30.61,7.77 29.85,7.01 29.85,3.58 28.07,1.81 J2.16
PA9: length 22.9
  Top Layer w0.254: U1.30 36.06,15.01 35.95,14.9 31.98,14.9 31.87,15.01 30.1,15.01 v2(29.46,14.38)
  Bottom Layer w0.254: J2.15 31.88,3.58 31.88,6.89 30.96,7.8 30.96,11.1 29.46,12.6 v2(29.46,14.38)
PA10: length 16.8
  Top Layer w0.254: U1.31 v2(39.12,14.51) ; J2.14 32.64,3.46 35.18,6 35.18,8.28 v2(38.04,11.14)
  Bottom Layer w0.254: v2(38.04,11.14) 39.12,12.22 v2(39.12,14.51)
PA11: length 42.1
  Top Layer w0.254: R6.2 12.14,10.39 13.08,11.33 24.38,11.33 26.16,13.11 30.79,13.11 v2(30.99,12.91) ; v2(33.78,14.12) 35.43,14.12 35.56,14 37.65,14 U1.32
  Bottom Layer w0.254: J2.13 35.18,8.71 v2(30.99,12.91) 32.56,12.91 v2(33.78,14.12)
PA12: length 48.3
  Top Layer w0.254: R5.2 10.16,8.74 9.31,9.59 9.31,11.2 10.16,12.04 R7.1 12.31,12.61 13.08,11.84 24.26,11.84 25.91,13.49 32.13,13.49 ; v2(34.42,3.96) 34.92,3.46 36.07,3.46 J2.12 ; 32.13,13.49 v2(32.13,9.3) ; 32.13,13.49 32.15,13.51 U1.33
  Bottom Layer w0.254: v2(34.42,3.96) 34.42,7.01 v2(32.13,9.3)
PA15: length 9
  Top Layer w0.254: J2.11 39.66,2.41 39.66,4.4 39.56,4.49 39.56,5.98 39.66,6.07 U1.38
PB0: length 14.4
  Top Layer w0.254: J1.8 35.18,24.16 35.81,23.52 37.65,23.52 37.67,23.5 39.77,23.5 42.16,21.11 U1.18
PB1: length 15.4
  Top Layer w0.254: J1.7 32.58,28.16 32.58,26.13 35.56,23.14 39.62,23.14 41.66,21.11 U1.19
PB3: length 9.8
  Top Layer w0.254: J2.10 42.8,1.93 41.78,2.95 41.78,5.74 40.16,7.37 U1.39
PB4: length 12.4
  Top Layer w0.254: J2.9 45.39,1.86 45.39,3.02 45.21,3.2 42.29,3.2 42.14,3.35 42.14,5.89 40.66,7.37 U1.40
PB5: length 13.4
  Top Layer w0.254: J2.8 46.03,3.66 44.94,3.66 44.76,3.84 44.76,6.07 44.58,6.25 42.42,6.25 41.16,7.51 U1.41
PB6: length 29.6
  Top Layer w0.254: U1.42 41.66,7.52 42.55,6.63 46.1,6.63 47.12,5.62 47.12,3.84 47.3,3.66 48.57,3.66 J2.7 ; v2(38.48,3.58) 38.48,4.9 PB6.1
  Bottom Layer w0.254: v2(38.48,3.58) 48.64,3.58 J2.7
PB7: length 29.3
  Top Layer w0.254: J2.6 52.96,2.57 52.32,3.2 50.17,3.2 49.58,3.79 49.58,6.2 49.4,6.38 46.86,6.38 46.25,6.99 42.95,6.99 42.16,7.77 42.16,10.51 U1.43
  Bottom Layer w0.254: J2.6 52.63,2.13 52.63,3.02 52.45,3.2 50.29,3.2 49.53,3.96 44.77,3.96 v2(43.5,5.23)
PB8: length 35.3
  Top Layer w0.254: H2.2 48.69,23.85 48.69,22.43 48.51,22.25 46.36,22.25 45.08,20.98 45.08,18.14 43.18,16.23 43.18,10.53 U1.45 43.16,8.68 44.5,7.34 46.44,7.34 47.05,6.73 51.44,6.73 51.82,6.35 51.82,4.09 52.32,3.58 53.72,3.58 J2.5
PB9: length 39.2
  Top Layer w0.254: H2.1 51.18,22.63 50.42,21.87 46.48,21.87 45.47,20.86 45.47,18.02 43.66,16.21 U1.46 43.66,8.69 44.65,7.7 46.59,7.7 47.15,7.14 53.21,7.14 54.23,6.12 54.23,3.84 54.41,3.66 56.19,3.66 J2.4
PB10: length 17
  Top Layer w0.254: U1.21 40.66,21.6 39.47,22.79 35.41,22.79 32.14,26.06 30.35,26.06 30.17,26.24 30.17,28.15 J1.6
PB11: length 18.7
  Top Layer w0.254: J1.5 27.56,26.82 27.81,26.57 29.34,26.57 30.21,25.71 31.99,25.71 35.27,22.43 39.32,22.43 40.16,21.59 U1.22
PB12: length 40.3
  Top Layer w0.254: v2(33.97,17.62) 34.08,17.51 U1.25 ; R12.2 29.35,7.8 28.68,7.8 28.58,7.9 26.92,7.9 26.74,8.08 v2(26.74,11.97) 26.29,11.97 24.26,9.93 22.57,9.93 21.5,8.86 20.36,8.86 19.41,7.91 19.41,3.82 J2.20
  Bottom Layer w0.254: v2(26.74,11.97) 26.74,15.85 27.94,17.05 33.4,17.05 v2(33.97,17.62)
PB13: length 28.3
  Top Layer w0.254: v2(23.75,12.85) 27.43,16.54 34.05,16.54 34.52,17.01 U1.26 ; J2.19 20.07,1.93 v2(20.07,4.98)
  Bottom Layer w0.254: v2(23.75,12.85) 23.75,8.66 v2(20.07,4.98)
PB14: length 27.4
  Top Layer w0.254: v2(35.18,16.28) 35.81,16.28 36.07,16.54 37.63,16.54 U1.27 ; v2(34.29,12.6) 33.27,12.6 33.12,12.45 33.12,4.98 32.87,4.73 25.4,4.73 J2.18
  Bottom Layer w0.254: v2(34.29,12.6) 34.29,13.81 34.37,13.88 34.37,14.37 34.29,14.44 34.29,15.39 v2(35.18,16.28)
PB15: length 25.3
  Top Layer w0.254: U1.28 36.05,16.01 35.67,15.63 34.95,15.63 34.62,15.95 v2(32.26,15.95)
  Bottom Layer w0.254: J2.17 25.53,1.81 27.3,3.58 27.3,11.7 27.4,11.8 27.4,12.46 27.3,12.55 27.3,14.51 28.75,15.95 v2(32.26,15.95)
PC13: length 30
  Top Layer w0.254: v2(48.39,16.79) 48.51,16.92 48.51,19.97 49,20.45 51.33,20.45 53.43,22.55 53.43,25.01 54.73,26.32 v2(55.5,26.32) ; v2(48.39,11.97) 47.84,12.51 U1.2
  Bottom Layer w0.254: v2(48.39,11.97) v2(48.39,16.79) ; J1.19 61.21,26.32 v2(55.5,26.32)
PC14: length 24.3
  Top Layer w0.254: U1.3 47.16,13.01 47.21,13.06 48.54,13.06 50.19,11.41 50.61,11.41 C14.2 52.54,11.41 54.6,11.41 56.35,9.65 59.22,9.65 61.41,11.84 62.03,11.84 62.43,12.24 62.43,12.86 62.91,13.34 63.83,13.34 64.01,13.16 X1.2
PC15: length 24.4
  Top Layer w0.254: U1.4 47.16,13.51 47.21,13.46 48.71,13.46 50.36,11.81 50.61,11.81 C15.2 52.54,11.81 54.77,11.81 56.52,10.06 59.05,10.06 61.24,12.25 61.86,12.25 62.02,12.41 62.02,13.03 63.25,14.25 63.83,14.25 64.01,14.43 X1.1
RESET: length 74.4
  Top Layer w0.254: v2(38.1,18.44) 31.19,25.35 30.06,25.35 29.47,25.94 25.65,25.94 25.02,26.57 J1.4 ; v2(44.58,15.01) U1.7 47.49,15.01 49.43,16.94 49.43,18.85 50.24,19.66 54.24,19.66 54.54,19.96 54.54,20.35 55.77,21.58 v2(55.77,22.13) ; v2(62.36,23.65) 62.36,24.68 C8.2 ; RESET.2 63.31,5.74 67.01,9.44 67.01,18.3 65.22,20.09 v2(62.36,20.09)
  Bottom Layer w0.254: v2(44.58,15.01) 41.53,15.01 v2(38.1,18.44) ; v2(62.36,20.09) v2(62.36,23.65) 62.1,23.4 59.05,23.4 57.79,22.13 v2(55.77,22.13)
SWCLK: length 38.4
  Top Layer w0.254: U1.37 39.25,10.6 39.25,11.3 39.75,11.8 v2(39.75,11.97)
  Bottom Layer w0.254: ST_LINK.2 67.95,12.98 67.44,12.47 67.44,8.92 66.17,7.65 62.1,7.65 60.96,6.5 55.88,6.5 54.74,7.65 49.15,7.65 44.83,11.97 v2(39.75,11.97)
SWDIO: length 40.3
  Top Layer w0.254: U1.34 v2(39.75,13.01)
  Bottom Layer w0.254: ST_LINK.3 69.47,15.01 67.08,12.62 67.08,9.17 66.12,8.21 62.05,8.21 60.71,6.86 56.03,6.86 54.88,8 49.43,8 44.42,13.01 v2(39.75,13.01)
$1N1344: length 3
  Top Layer w0.4: PWR.2 11.3,27.75 R3.2
$1N2331: length 3.7
  Top Layer w0.254: USB2.3 7.02,9.3 R5.1
$1N2336: length 3.4
  Top Layer w0.254: USB2.2 7.71,9.95 R6.1
$1N2763: length 10.1
  Top Layer w0.254: R8.1 48.7,5.29 v2(48.7,5.3)
  Bottom Layer w0.254: v2(40.34,5.23) 42.25,7.14 46.86,7.14 v2(48.7,5.3)
$1N2764: length 8.2
  Bottom Layer w0.254: v2(53.21,5.11) 52.45,4.35 46.59,4.35 v2(45.7,5.23)
$1N3345: length 15.5
  Top Layer w0.254: R10.2 8.14,6.39 8.64,6.89 11.43,6.89 13.79,9.25 20.78,9.25 20.96,9.43 USB.5
$1N5496: length 5.1
  Top Layer w0.254: Q1.1 27.95,7.2 R12.1
$1N5497: length 16.5
  Top Layer w0.254: Q1.3 27.07,6.25 27.69,5.64 27.69,5.29 27.87,5.11 32.51,5.11 32.77,5.36 32.77,7.52 32.13,8.16 28.83,8.16 28.65,8.34 28.65,10.78 BUZZER.1

## Copper pours and planes (outline as drawn; the poured copper is in the pictures)
GND on Top Layer: -0.76,30.63 75.82,30.63 75.82,-3.4 -0.76,-3.4
GND on Bottom Layer: -0.25,30 73.79,30 73.79,-0.48 -0.25,-0.48

Small or netless copper shapes (teardrops, artwork), in the pictures only: 148 on Top Layer, 74 on Bottom Layer

## Text on the board
Bottom Silkscreen Layer: STM32最小系统板 | DESIGNED_BY LZM | 2025/2/8
Top Silkscreen Layer: 100nF | ST_L | USB | GND | B12 | B13 | VCC | B14 | RST | B15 | A8 | B11 | B10 | A9 | A10 | B1 | B0 | A11 | A12 | A7 | A15 | A6 | A5 | B3 | A4 | B4 | OLED | A3 | B5 | A2 | B6 | B7 | A1 | A0 | B8 | B9 | 5V | C13 | VBAT
